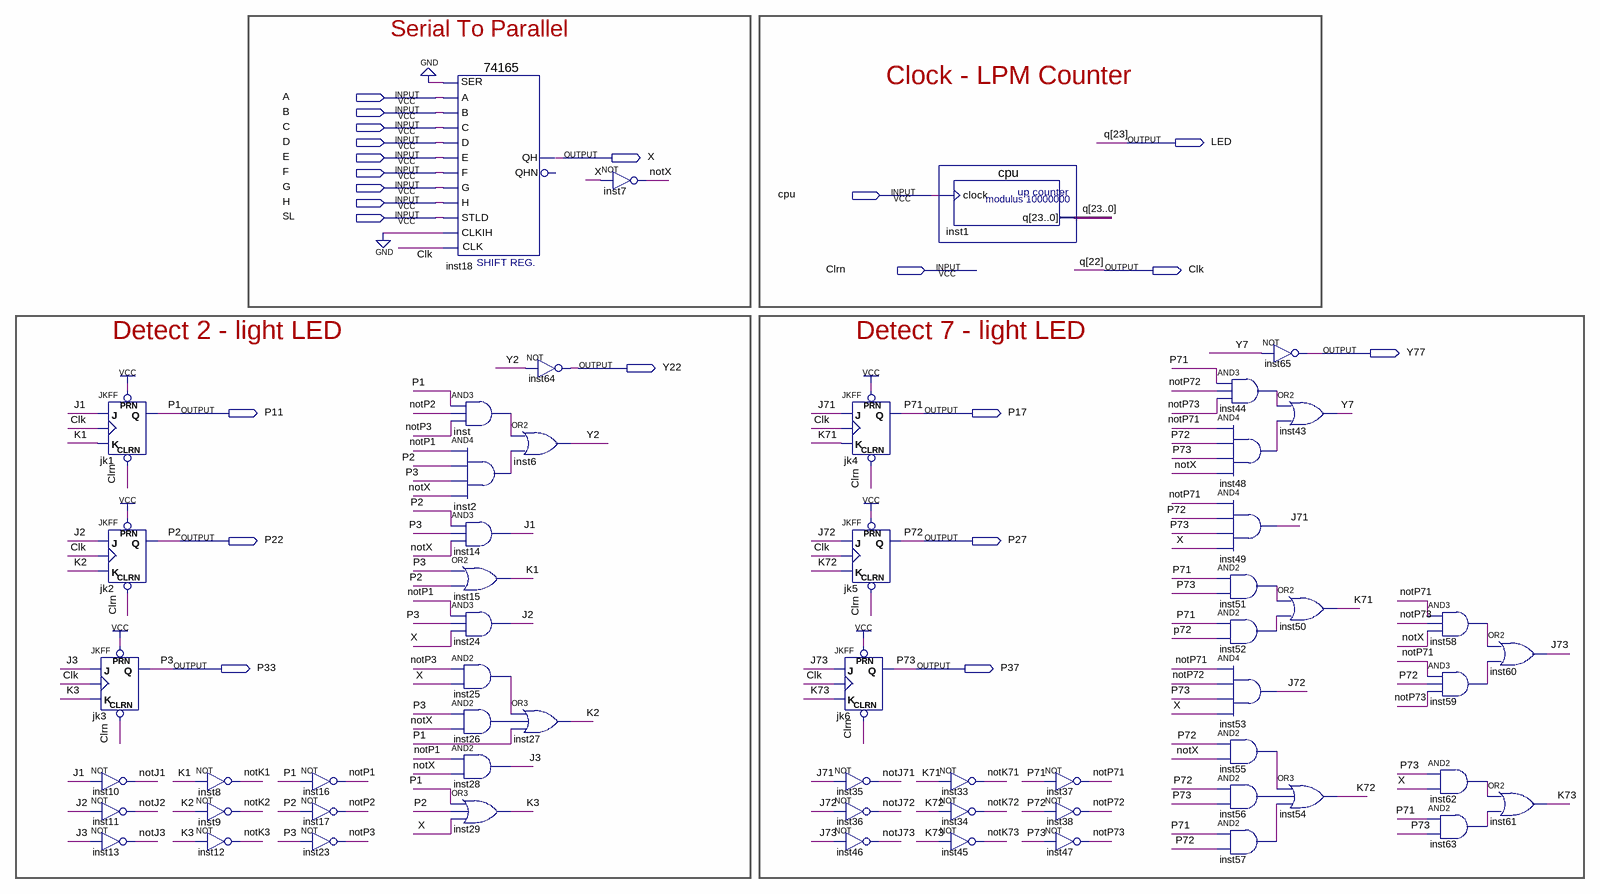
[diagram p0: schematic sheet]
// Quartus schematic detect7n2.bdf as structural Verilog: 58 symbols, 22 pins
module detect7n2 (
  input  A,
  input  B,
  input  C,
  input  D,
  input  E,
  input  F,
  input  G,
  input  cpu,
  input  H,
  input  SL,
  input  Clrn,
  output LED,
  output X,
  output Clk,
  output Y77,
  output Y22,
  output P11,
  output P17,
  output P22,
  output P27,
  output P33,
  output P37
);

  wire inst2_out, inst25_out, inst26_out, inst44_out, inst48_out, inst51_out, inst52_out, inst55_out,
       inst56_out, inst57_out, inst58_out, inst59_out, inst62_out, inst63_out, inst_out, J1, J2, J3, J71,
       J72, J73, K1, K2, K3, K71, K72, K73, notJ1, notJ2, notJ3, notJ71, notJ72, notJ73, notK1, notK2, notK3,
       notK71, notK72, notK73, notP1, notP2, notP3, notP71, notP72, notP73, notX, Y2, Y7;
  wire [21:0] q;

  JKFF jk1 (.PRN(1'b1), .CLRN(Clrn), .K(K1), .J(J1), .CLK(Clk), .Q(P11));
  JKFF jk2 (.PRN(1'b1), .CLRN(Clrn), .K(K2), .J(J2), .CLK(Clk), .Q(P22));
  JKFF jk3 (.PRN(1'b1), .CLRN(Clrn), .K(K3), .J(J3), .CLK(Clk), .Q(P33));
  not inst10 (notJ1, J1);
  not inst11 (notJ2, J2);
  not inst13 (notJ3, J3);
  not inst8 (notK1, K1);
  not inst9 (notK2, K2);
  not inst12 (notK3, K3);
  not inst16 (notP1, P11);
  not inst17 (notP2, P22);
  not inst23 (notP3, P33);
  \74165  inst18 (
    .D(D), .C(C), .B(B), .G(G), .H(H), .A(A), .CLKIH(1'b0), .E(E), .F(F), .CLK(Clk), .STLD(SL), .SER(1'b0),
    .QH(X));  // open: QHN
  and inst (inst_out, P11, notP2, notP3);
  and inst2 (inst2_out, notP1, P22, P33, notX);
  and inst14 (J1, P22, P33, notX);
  or inst15 (K1, P33, P22);
  and inst24 (J2, notP1, P33, X);
  and inst25 (inst25_out, notP3, X);
  and inst26 (inst26_out, P33, notX);
  and inst28 (J3, notP1, notX);
  or inst29 (K3, P11, P22, X);
  not inst64 (Y22, Y2);
  or inst6 (Y2, inst_out, inst2_out);
  or inst27 (K2, inst25_out, inst26_out, P11);
  not inst7 (notX, X);
  JKFF jk4 (.PRN(1'b1), .CLRN(Clrn), .K(K71), .J(J71), .CLK(Clk), .Q(P17));
  JKFF jk5 (.PRN(1'b1), .CLRN(Clrn), .K(K72), .J(J72), .CLK(Clk), .Q(P27));
  JKFF jk6 (.PRN(1'b1), .CLRN(Clrn), .K(K73), .J(J73), .CLK(Clk), .Q(P37));
  not inst35 (notJ71, J71);
  not inst36 (notJ72, J72);
  not inst46 (notJ73, J73);
  cpu inst1 (.clock(cpu), .q({LED, Clk, q}));
  not inst33 (notK71, K71);
  not inst34 (notK72, K72);
  not inst45 (notK73, K73);
  not inst37 (notP71, P17);
  not inst38 (notP72, P27);
  not inst47 (notP73, P37);
  and inst44 (inst44_out, P17, notP72, notP73);
  and inst48 (inst48_out, notP71, P27, P37, notX);
  and inst49 (J71, notP71, P27, P37, X);
  and inst51 (inst51_out, P17, P37);
  and inst52 (inst52_out, P17, P27);
  and inst53 (J72, notP71, notP72, P37, X);
  and inst55 (inst55_out, P27, notX);
  and inst56 (inst56_out, P27, P37);
  and inst57 (inst57_out, P17, P27);
  not inst65 (Y77, Y7);
  or inst43 (Y7, inst44_out, inst48_out);
  or inst50 (K71, inst51_out, inst52_out);
  or inst54 (K72, inst55_out, inst56_out, inst57_out);
  and inst58 (inst58_out, notP71, notP73, notX);
  and inst59 (inst59_out, notP71, P27, notP73);
  and inst62 (inst62_out, P37, X);
  and inst63 (inst63_out, P17, P37);
  or inst60 (J73, inst58_out, inst59_out);
  or inst61 (K73, inst62_out, inst63_out);

  // Other names for the same wires on the sheet: P1 = P11; P2 = P22; P3 = P33; P71 = P17; P72 = P27; P73 = P37;
  //   q[23:22] = {LED, Clk}

  // Notes on the sheet:
  //   Serial To Parallel
  //   Clock - LPM Counter
  //   Detect 2 - light LED
  //   Detect 7 - light LED
endmodule
